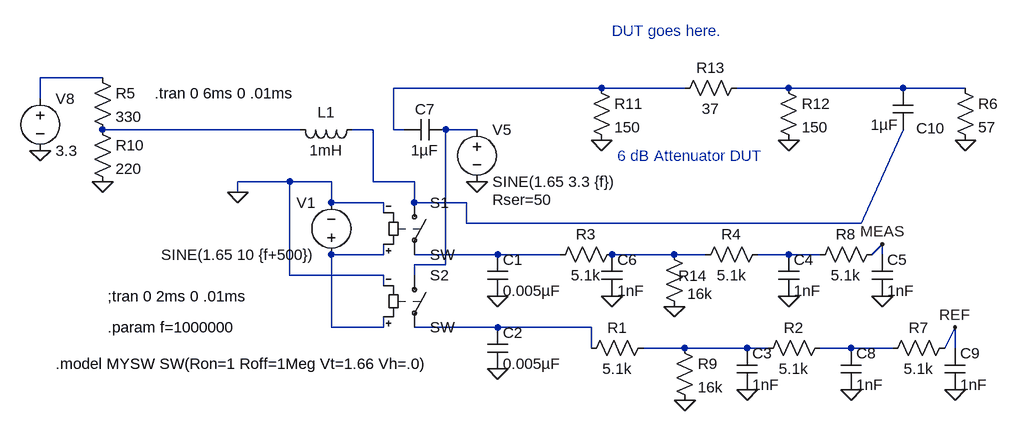
[diagram p0: schematic VNA2018.asc]
VNA2018.asc, the LTspice schematic file:
Version 4
SHEET 1 1056 888
WIRE -400 -96 -496 -96
WIRE 368 -80 48 -80
WIRE 496 -80 368 -80
WIRE 656 -80 576 -80
WIRE 832 -80 656 -80
WIRE 928 -80 832 -80
WIRE -496 -64 -496 -96
WIRE -96 -16 -400 -16
WIRE 16 -16 -16 -16
WIRE 48 -16 48 -80
WIRE 64 -16 48 -16
WIRE 176 -16 128 -16
WIRE -112 64 -192 64
WIRE -48 64 -112 64
WIRE 16 64 16 -16
WIRE 80 64 16 64
WIRE -192 80 -192 64
WIRE -48 96 -48 64
WIRE 32 96 -48 96
WIRE 80 96 80 64
WIRE 160 96 80 96
WIRE 32 112 32 96
WIRE 160 128 160 96
WIRE 768 128 832 -16
WIRE 768 128 160 128
WIRE 32 176 32 160
WIRE 32 176 -48 176
WIRE 208 176 80 176
WIRE 304 176 208 176
WIRE 480 176 384 176
WIRE 528 176 480 176
WIRE 656 176 608 176
WIRE 704 176 656 176
WIRE 784 176 800 160
WIRE 800 176 800 160
WIRE 128 192 128 -16
WIRE 128 192 80 192
WIRE -112 208 -112 64
WIRE 32 208 -112 208
WIRE 80 208 80 192
WIRE 32 224 32 208
WIRE -48 288 -48 176
WIRE 32 288 32 272
WIRE 32 288 -48 288
WIRE 208 288 80 288
WIRE 352 288 208 288
WIRE 352 320 352 288
WIRE 496 320 432 320
WIRE 592 320 496 320
WIRE 624 320 592 320
WIRE 752 320 704 320
WIRE 816 320 752 320
WIRE 896 320 912 288
WIRE 912 320 912 288
FLAG 208 352 0
FLAG 176 64 0
FLAG -192 80 0
FLAG -496 16 0
FLAG 208 240 0
FLAG 592 384 0
FLAG 752 384 0
FLAG 912 384 0
FLAG 656 240 0
FLAG 800 240 0
FLAG 384 240 0
FLAG 800 160 MEAS
FLAG 912 288 REF
FLAG -400 64 0
FLAG 656 0 0
FLAG 368 0 0
FLAG 928 0 0
FLAG 496 400 0
FLAG 480 256 0
SYMBOL sw 80 80 R0
SYMATTR InstName S1
SYMATTR SpiceModel MYSW
SYMBOL sw 80 192 R0
SYMATTR InstName S2
SYMATTR SpiceModel MYSW
SYMBOL voltage -48 192 R180
WINDOW 0 24 96 Left 2
WINDOW 3 24 16 Left 2
WINDOW 123 0 0 Left 2
WINDOW 39 0 0 Left 2
SYMATTR InstName V1
SYMATTR Value SINE(1.65 10 {f+500})
SYMBOL cap 192 176 R0
SYMATTR InstName C1
SYMATTR Value 0.005µF
SYMBOL cap 192 288 R0
SYMATTR InstName C2
SYMATTR Value 0.005µF
SYMBOL voltage 176 -32 R0
WINDOW 123 0 0 Left 2
WINDOW 39 24 124 Left 2
SYMATTR SpiceLine Rser=50
SYMATTR InstName V5
SYMATTR Value SINE(1.65 3.3 {f})
SYMBOL res 448 304 R90
WINDOW 0 0 56 VBottom 2
WINDOW 3 32 56 VTop 2
SYMATTR InstName R1
SYMATTR Value 5.1k
SYMBOL res 400 160 R90
WINDOW 0 0 56 VBottom 2
WINDOW 3 32 56 VTop 2
SYMATTR InstName R3
SYMATTR Value 5.1k
SYMBOL voltage -496 -80 R0
WINDOW 123 0 0 Left 2
WINDOW 39 0 0 Left 2
SYMATTR InstName V8
SYMATTR Value 3.3
SYMBOL res -416 -112 R0
SYMATTR InstName R5
SYMATTR Value 330
SYMBOL cap 128 -32 R90
WINDOW 0 0 32 VBottom 2
WINDOW 3 32 32 VTop 2
SYMATTR InstName C7
SYMATTR Value 1µF
SYMBOL ind 0 -32 R90
WINDOW 0 5 56 VBottom 2
WINDOW 3 32 56 VTop 2
SYMATTR InstName L1
SYMATTR Value 1mH
SYMATTR SpiceLine Ipk=0.43 Rser=2.58 Rpar=94200 Cpar=0
SYMBOL cap 736 320 R0
SYMATTR InstName C8
SYMATTR Value 1nF
SYMBOL cap 896 320 R0
SYMATTR InstName C9
SYMATTR Value 1nF
SYMBOL res 720 304 R90
WINDOW 0 0 56 VBottom 2
WINDOW 3 32 56 VTop 2
SYMATTR InstName R2
SYMATTR Value 5.1k
SYMBOL res 912 304 R90
WINDOW 0 0 56 VBottom 2
WINDOW 3 32 56 VTop 2
SYMATTR InstName R7
SYMATTR Value 5.1k
SYMBOL cap 640 176 R0
SYMATTR InstName C4
SYMATTR Value 1nF
SYMBOL cap 784 176 R0
SYMATTR InstName C5
SYMATTR Value 1nF
SYMBOL res 624 160 R90
WINDOW 0 0 56 VBottom 2
WINDOW 3 32 56 VTop 2
SYMATTR InstName R4
SYMATTR Value 5.1k
SYMBOL res 800 160 R90
WINDOW 0 0 56 VBottom 2
WINDOW 3 32 56 VTop 2
SYMATTR InstName R8
SYMATTR Value 5.1k
SYMBOL cap 368 176 R0
SYMATTR InstName C6
SYMATTR Value 1nF
SYMBOL cap 576 320 R0
SYMATTR InstName C3
SYMATTR Value 1nF
SYMBOL res -416 -32 R0
SYMATTR InstName R10
SYMATTR Value 220
SYMBOL res 352 -96 R0
SYMATTR InstName R11
SYMATTR Value 150
SYMBOL res 640 -96 R0
SYMATTR InstName R12
SYMATTR Value 150
SYMBOL res 592 -96 R90
WINDOW 0 0 56 VBottom 2
WINDOW 3 32 56 VTop 2
SYMATTR InstName R13
SYMATTR Value 37
SYMBOL cap 848 -16 R180
WINDOW 0 -49 2 Left 2
WINDOW 3 24 8 Left 2
SYMATTR InstName C10
SYMATTR Value 1µF
SYMBOL res 912 -96 R0
SYMATTR InstName R6
SYMATTR Value 57
SYMBOL res 480 304 R0
SYMATTR InstName R9
SYMATTR Value 16k
SYMBOL res 464 160 R0
WINDOW 0 22 49 Left 2
SYMATTR InstName R14
SYMATTR Value 16k
TEXT -320 -72 Left 2 !.tran 0 6ms 0 .01ms
TEXT -392 240 Left 2 !;tran 0 2ms 0 .01ms
TEXT 384 -168 Left 2 ;DUT goes here.
TEXT -392 288 Left 2 !.param f=1000000
TEXT -472 344 Left 2 !.model MYSW SW(Ron=1 Roff=1Meg Vt=1.66 Vh=.0)
TEXT 392 24 Left 2 ;6 dB Attenuator DUT

The netlist it stands for:
* VNA2018.asc
S1 N005 N008 N007 0 MYSW SW
S2 N006 N011 N007 0 MYSW SW
V1 N007 0 SINE(1.65 10 {f+500})
C1 N008 0 0.005µF
C2 N011 0 0.005µF
V5 N006 0 SINE(1.65 3.3 {f}) Rser=50
R1 N012 N011 5.1k
R3 N009 N008 5.1k
V8 N001 0 3.3
R5 N001 N004 330
C7 N006 N002 1µF
L1 N005 N004 1mH Ipk=0.43 Rser=2.58 Rpar=94200 Cpar=0
C8 N013 0 1nF
C9 REF 0 1nF
R2 N013 N012 5.1k
R7 REF N013 5.1k
C4 N010 0 1nF
C5 MEAS 0 1nF
R4 N010 N009 5.1k
R8 MEAS N010 5.1k
C6 N009 0 1nF
C3 N012 0 1nF
R10 N004 0 220
R11 N002 0 150
R12 N003 0 150
R13 N003 N002 37
C10 N005 N003 1µF
R6 N003 0 57
R9 N012 0 16k
R14 N009 0 16k
.tran 0 6ms 0 .01ms
;tran 0 2ms 0 .01ms
* DUT goes here.
.param f=1000000
.model MYSW SW(Ron=1 Roff=1Meg Vt=1.66 Vh=.0)
* 6 dB Attenuator DUT
.backanno
.end